# EAGLE schematic Street_Fighter_v1.1 (EAGLE 7.5.0)
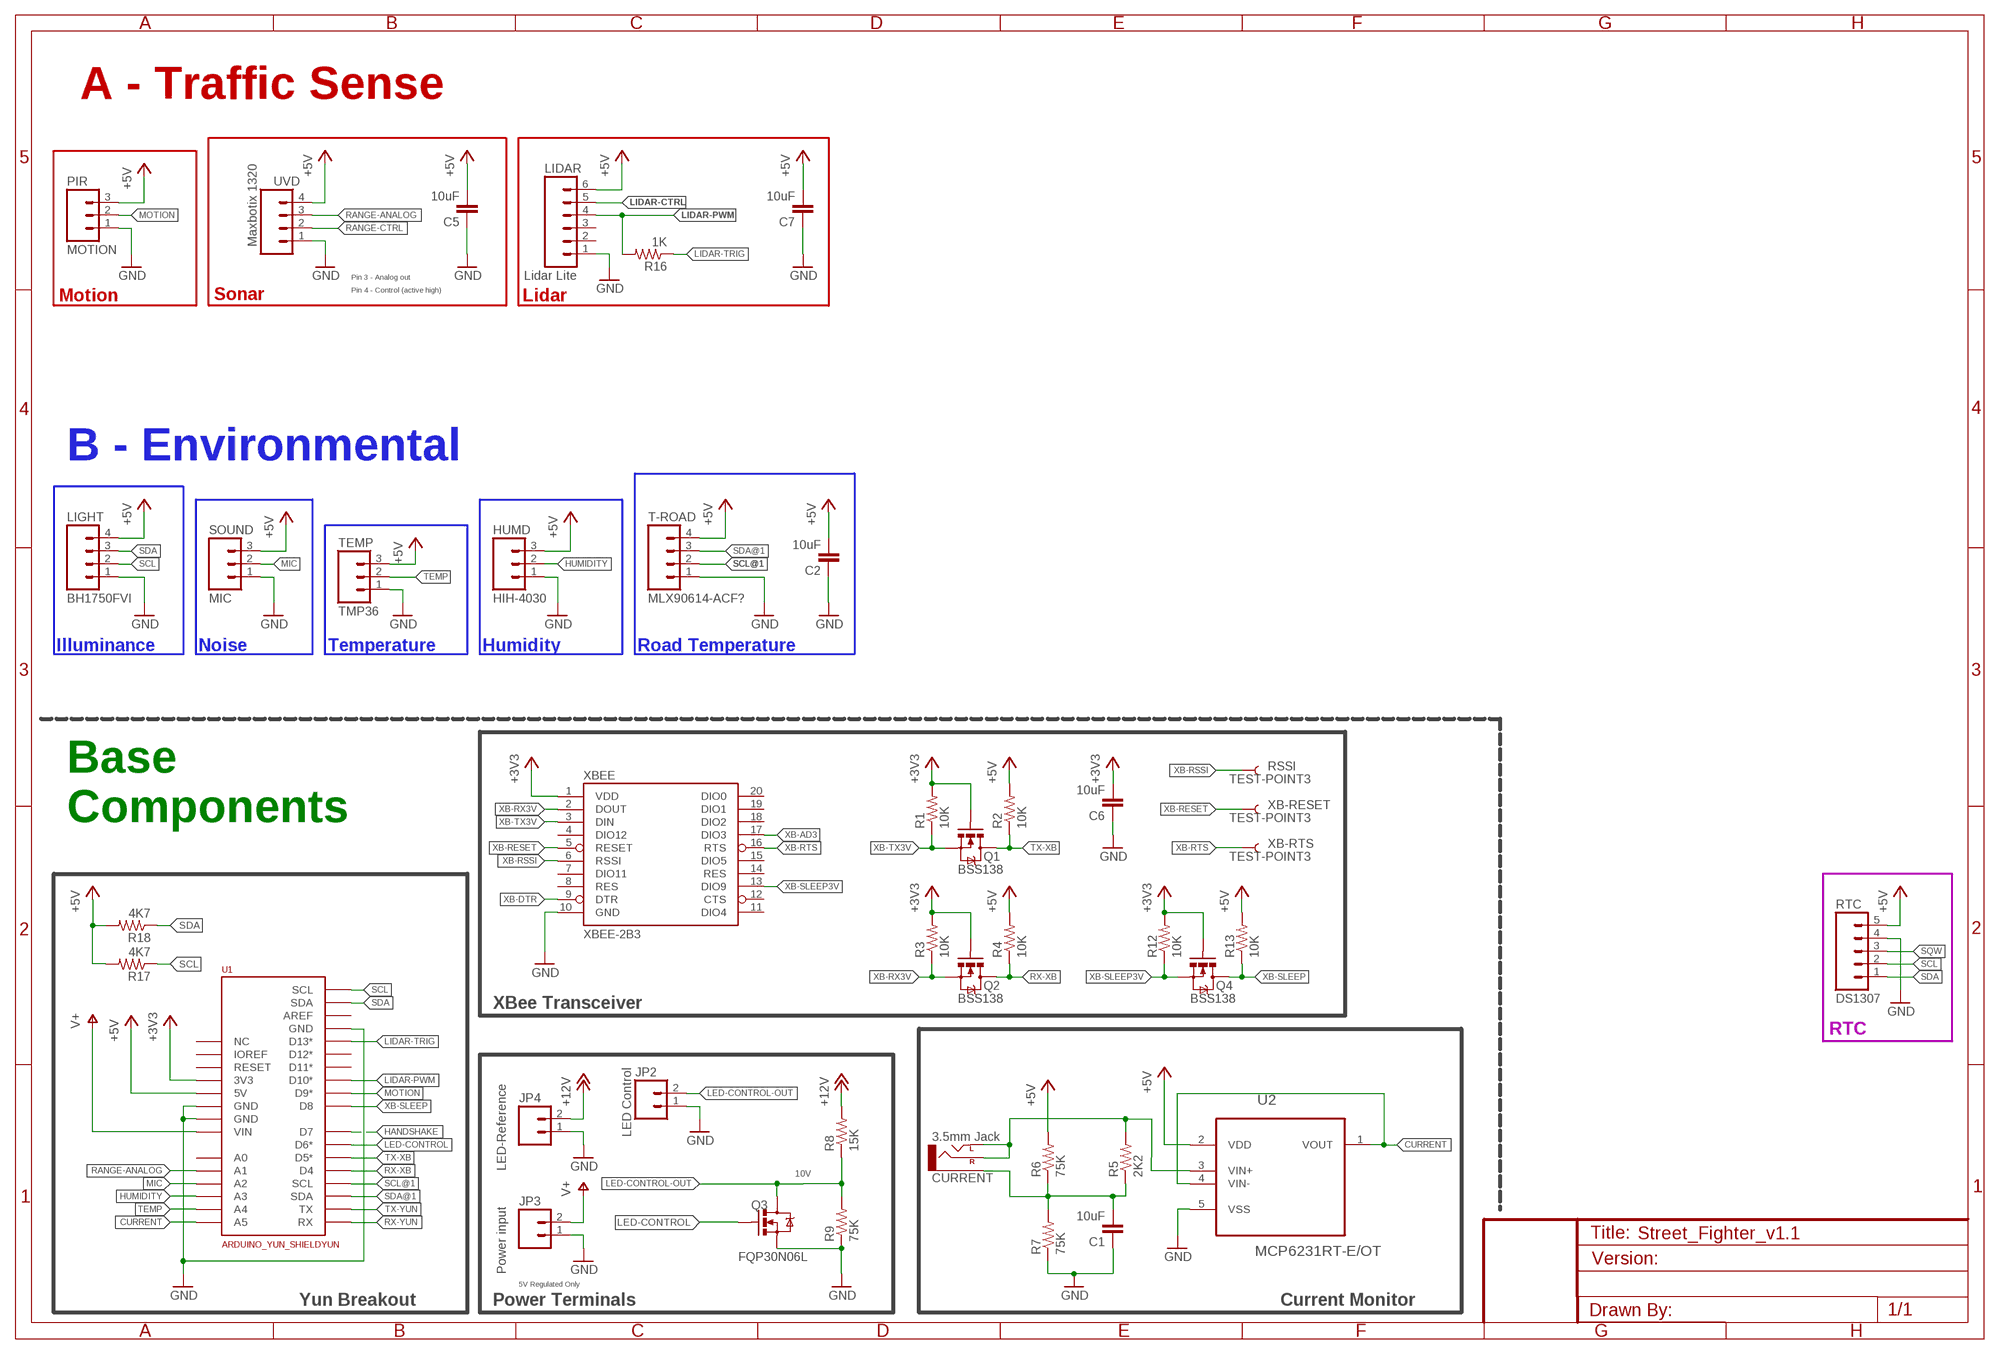
[diagram p0: schematic, sheet 1]

## Parts
C1  10uF  10UF-6.3V-20%(1206)  [1206]
C2  10uF  10UF-6.3V-20%(1206)  [1206]
C5  10uF  10UF-6.3V-20%(1206)  [1206]
C6  10uF  10UF-6.3V-20%(1206)  [1206]
C7  10uF  10UF-6.3V-20%(1206)  [1206]
CURRENT  3.5mm Jack  AUDIO-JACKPTH  [AUDIO-JACK]
HUMD  HIH-4030  M03PTH  [1X03]
JP2  LED Control  M02PTH3  [1X02_LONGPADS]
JP3  Power input  M02PTH3  [1X02_LONGPADS]
JP4  LED-Reference  M02PTH3  [1X02_LONGPADS]
LIDAR  Lidar Lite  M06SIP  [1X06]
LIGHT  BH1750FVI  M04PTH  [1X04]
PIR  MOTION  M03PTH  [1X03]
Q1  BSS138  MOSFET-NCHANNELBSS123LT1G  [SOT23]
Q2  BSS138  MOSFET-NCHANNELBSS123LT1G  [SOT23]
Q3  FQP30N06L  MOSFET-NCHANNELFQP30N06L  [TO220V]
Q4  BSS138  MOSFET-NCHANNELBSS123LT1G  [SOT23]
R1  10K  RESISTOR1206  [1206]
R2  10K  RESISTOR1206  [1206]
R3  10K  RESISTOR1206  [1206]
R4  10K  RESISTOR1206  [1206]
R5  2K2  RESISTOR1206  [1206]
R6  75K  RESISTOR1206  [1206]
R7  75K  RESISTOR1206  [1206]
R8  15K  RESISTOR1206  [1206]
R9  75K  RESISTOR1206  [1206]
R12  10K  RESISTOR1206  [1206]
R13  10K  RESISTOR1206  [1206]
R16  1K  RESISTOR1206  [1206]
R17  4K7  RESISTOR1206  [1206]
R18  4K7  RESISTOR1206  [1206]
RSSI  TEST-POINT3  [PAD.03X.03]
RTC  DS1307  M05PTH  [1X05]
SOUND  MIC  M03PTH  [1X03]
T-ROAD  MLX90614-ACF?  M04PTH  [1X04]
TEMP  TMP36  M03PTH  [1X03]
U1  ARDUINO_YUN_SHIELDYUN  [DUEMILANOVE_VIAS]
U2  MCP6231RT-E/OT  [SOT95P270X145-5N]
UVD  Maxbotix 1320  M04PTH  [1X04]
XB-RESET  TEST-POINT3  [PAD.03X.03]
XB-RTS  TEST-POINT3  [PAD.03X.03]
XBEE  XBEE-2B3  [XBEE-SMD]

## Nets
+3V3: C6.2 Q1.1(G) Q2.1(G) Q4.1(G) R1.2 R3.2 R12.2 U1.3V3 XBEE.1(VDD)
+5V: C2.2 C5.2 C7.2 HUMD.3 LIDAR.6 LIGHT.4 PIR.3 R2.2 R4.2 R6.2 R13.2 R17.2 R18.2 RTC.5 SOUND.3 T-ROAD.4 TEMP.3 U1.5V U2.2(VDD) UVD.4
+12V: JP4.2 R8.2
CURRENT: U1.A5 U2.1(VOUT) U2.4(VIN-)
GND: C1.1 C2.1 C5.1 C6.1 C7.1 HUMD.1 JP2.1 JP3.1 JP4.1 LIDAR.1 LIGHT.1 PIR.1 Q3.3(S) R7.1 R9.1 RTC.4 SOUND.1 T-ROAD.1 TEMP.1 U1.GND U1.GND@0(GND) U1.GND@1(GND) U2.5(VSS) UVD.1 XBEE.10(GND)
HANDSHAKE: U1.7(D7)
HUMIDITY: HUMD.2 U1.A3
LED-CONTROL: Q3.1(G) U1.6(D6*)
LED-CONTROL-OUT: JP2.2 Q3.2(D) R8.1 R9.2
LIDAR-CTRL: LIDAR.5
LIDAR-PWM: LIDAR.4 R16.2 U1.10(D10*)
LIDAR-TRIG: R16.1 U1.13(D13*)
MIC: SOUND.2 U1.A2
MOTION: PIR.2 U1.9(D9*)
N$2: CURRENT.RING(RIGHT) CURRENT.TIP(LEFT) R5.2 U2.3(VIN+)
N$4: C1.2 CURRENT.SLEEVE R5.1 R6.1 R7.2
RANGE-ANALOG: U1.A1 UVD.3
RANGE-CTRL: UVD.2
RX-XB: Q2.3(D) R4.1 U1.D4
RX-YUN: U1.0(RX)
SCL: LIGHT.2 R17.1 RTC.2 U1.3@1(SCL)
SCL@1: T-ROAD.2 U1.3(SCL)
SDA: LIGHT.3 R18.1 RTC.1 U1.2@1(SDA)
SDA@1: T-ROAD.3 U1.2(SDA)
SQW: RTC.3
TEMP: TEMP.2 U1.A4
TX-XB: Q1.3(D) R2.1 U1.5(D5*)
TX-YUN: U1.1(TX)
V+: JP3.2 U1.VIN
XB-AD3: XBEE.17(DIO3)
XB-DTR: XBEE.9(DTR)
XB-RESET: XB-RESET.P$1 XBEE.5(RESET)
XB-RSSI: RSSI.P$1 XBEE.6(RSSI)
XB-RTS: XB-RTS.P$1 XBEE.16(RTS)
XB-RX3V: Q2.2(S) R3.1 XBEE.2(DOUT)
XB-SLEEP: Q4.3(D) R13.1 U1.8(D8)
XB-SLEEP3V: Q4.2(S) R12.1 XBEE.13(DIO9)
XB-TX3V: Q1.2(S) R1.1 XBEE.3(DIN)
Unconnected: LIDAR.2 LIDAR.3 U1.11(D11*) U1.12(D12*) U1.A0 U1.AREF U1.IOREF U1.NC U1.RESET XBEE.4(DIO12) XBEE.7(DIO11) XBEE.8(RES) XBEE.11(DIO4) XBEE.12(CTS) XBEE.14(RES) XBEE.15(DIO5) XBEE.18(DIO2) XBEE.19(DIO1) XBEE.20(DIO0)

## Notes on the sheet
- A - Traffic Sense
- Pin 3 - Analog out
- Pin 4 - Control (active high)
- Motion | Sonar | Lidar
- B - Environmental
- Illuminance | Noise | Temperature | Humidity | Road Temperature
- Base 
  Components
- XBee Transceiver
- RTC
- 10V
- 5V Regulated Only
- Yun Breakout | Power Terminals | Current Monitor

## Library data of the parts
C1 C2 C5-C7 = SparkFun-Capacitors:10UF-6.3V-20%(1206): Ceramic CAP-10057; PROD_ID: CAP-10057
CURRENT = SparkFun-Connectors:AUDIO-JACK: 3.5mm Audio Jack Simple 3.5mm common PCB mount audio jack. SKU: PRT-08032
HUMD PIR SOUND TEMP = SparkFun-Connectors:M03: Header 3 Standard 3-pin 0.1" header. Use with straight break away headers (SKU : PRT-00116), right angle break away headers (PRT-00553), swiss pins (PRT-00743), machine pins (PRT-00117), and female headers (PRT-00115). Molex polarized connector foot print use with SKU : PRT-08232 with associated crimp pins and housings.
JP2-JP4 = SparkFun-Connectors:M02: Header 2 Standard 2-pin 0.1" header. Use with straight break away headers (SKU : PRT-00116), right angle break away headers (PRT-00553), swiss pins (PRT-00743), machine pins (PRT-00117), and female headers (PRT-00115). Molex polarized connector foot print use with SKU : PRT-08233 with associated crimp pins and housings.
LIDAR = SparkFun-Connectors:M06: Header 6 Standard 6-pin 0.1" header. Use with straight break away headers (SKU : PRT-00116), right angle break away headers (PRT-00553), swiss pins (PRT-00743), machine pins (PRT-00117), and female headers (PRT-00115). Molex polarized connector foot print use with SKU : PRT-08094 with associated crimp pins and housings. NOTES ON THE VARIANTS LOCK and LOCK_LONGPADS... This footprint was designed to help hold the alignment of a through-hole component (i.e. 6-pin header) while soldering it into place. You may notice that each hole has been shifted either up or down by 0.005 of an inch from it's more standard position (which is a perfectly straight line). This slight alteration caused the pins (the squares in the middle) to touch the edges of the holes. Because they are alternating, it causes a "brace" to hold the component in place. 0.005 has proven to be the perfect amount of "off-center" position when using our standard breakaway headers. Although looks a little odd when you look at the bare footprint, once you have a header in there, the alteration is very hard to notice. Also, if you push a header all the way into place, it is covered up entirely on the bottom side. This idea of altering the position of holes to aid alignment will be further integrated into the Sparkfun Library for other footprints. It can help hold any component with 3 or more connection pins.
LIGHT T-ROAD UVD = SparkFun-Connectors:M04: Header 4 Standard 4-pin 0.1" header. Use with straight break away headers (SKU : PRT-00116), right angle break away headers (PRT-00553), swiss pins (PRT-00743), machine pins (PRT-00117), and female headers (PRT-00115). Molex polarized connector foot print use with SKU : PRT-08231 with associated crimp pins and housings. 1MM SMD Version SKU: PRT-10208
Q1 Q2 Q4 = SparkFun-DiscreteSemi:MOSFET-NCHANNEL: Common NMOSFET Parts MFG P/N Store ID Prod ID FDD8780 TRANS-09984 SI7820DN TRANS-11055 FDS6630A IC-08089 2N7002PW TRANS-11151 FQP30N06L COM-10213 TRANS-10060 BSS123LT1G TRANS-08345 BSS138 TRANS-00830 BS170 2N7000; PROD_ID: TRANS-08345
Q3 = SparkFun-DiscreteSemi:MOSFET-NCHANNEL: Common NMOSFET Parts MFG P/N Store ID Prod ID FDD8780 TRANS-09984 SI7820DN TRANS-11055 FDS6630A IC-08089 2N7002PW TRANS-11151 FQP30N06L COM-10213 TRANS-10060 BSS123LT1G TRANS-08345 BSS138 TRANS-00830 BS170 2N7000; PROD_ID: TRANS-10060
R1-R9 R12 R13 R16-R18 = SparkFun-Passives:RESISTOR: Resistor Basic schematic elements and footprints for 0603, 1206, and PTH resistors.
RSSI XB-RESET XB-RTS = SparkFun-Passives:TEST-POINT: Bare copper test points for troubleshooting or ICT
RTC = SparkFun-Connectors:M05: Header 5 Standard 5-pin 0.1" header. Use with straight break away headers (SKU : PRT-00116), right angle break away headers (PRT-00553), swiss pins (PRT-00743), machine pins (PRT-00117), and female headers (PRT-00115). Molex polarized connector foot print use with SKU : PRT-08230 with associated crimp pins and housings.
U1 = SparkFun-Boards:ARDUINO_YUN_SHIELD
U2 = Microchip_By_element14_Batch_1:MCP6231RT-E/OT: 20 µA, 300 kHz Rail-to-Rail Op Amp; DESCRIPTION: OP AMP; MPN: MCP6231RT-E/OT; OC_FARNELL: 1840878; OC_NEWARK: 84R5186; PACKAGE: SOT-5; SUPPLIER: Microchip
XBEE = SparkFun-RF:XBEE-2: Xbee module footprints SMT header is CONN-09042.; PROD_ID: CONN-09042